# Altium schematic sheet LCD16x2.SchDoc
size A4
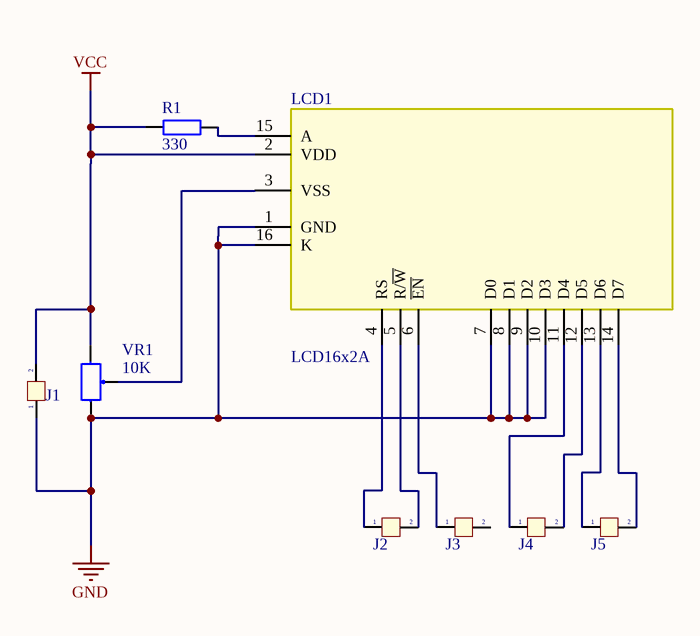
[diagram p0: LCD16x2.SchDoc]

## Parts
J1  Jumper 2  [JP2]  (value not drawn)
J2  Jumper 2  [JP2]  (value not drawn)
J3  Jumper 2  [JP2]  (value not drawn)
J4  Jumper 2  [JP2]  (value not drawn)
J5  Jumper 2  [JP2]  (value not drawn)
LCD1  LCD16x2A  [LCD16X2]
R1  330  [R1/4W]
VR1  10K  [VR]

## Nets
GND: J1.1 LCD1.1(GND) LCD1.7(D0) LCD1.8(D1) LCD1.9(D2) LCD1.10(D3) LCD1.16(K) VR1.3
VCC: J1.2 LCD1.2(VDD) R1.1 VR1.1
NetJ2_1: J2.1 LCD1.4(RS)
NetJ2_2: J2.2 LCD1.5(R/~{W})
NetJ3_1: J3.1 LCD1.6(~{EN})
NetJ4_1: J4.1 LCD1.11(D4)
NetJ4_2: J4.2 LCD1.12(D5)
NetJ5_1: J5.1 LCD1.13(D6)
NetJ5_2: J5.2 LCD1.14(D7)
NetLCD1_3: LCD1.3(VSS) VR1.2
NetLCD1_15: LCD1.15(A) R1.2

Not connected (* = marked no-connect by the designer): J3 2

## Library data of the parts
J1-J5 = JP 2: Value: JP 2
LCD1 = LCD16x2: LCD dipslay 16 char, 2 line; Value: LCD16x2A
R1 = R1/4W: Resistor 1/4W; Value: R1/4W - 1K
VR1 = VR: Var Resistor; Value: VR 10K